# Altium project SAIL V3.PrjPcb
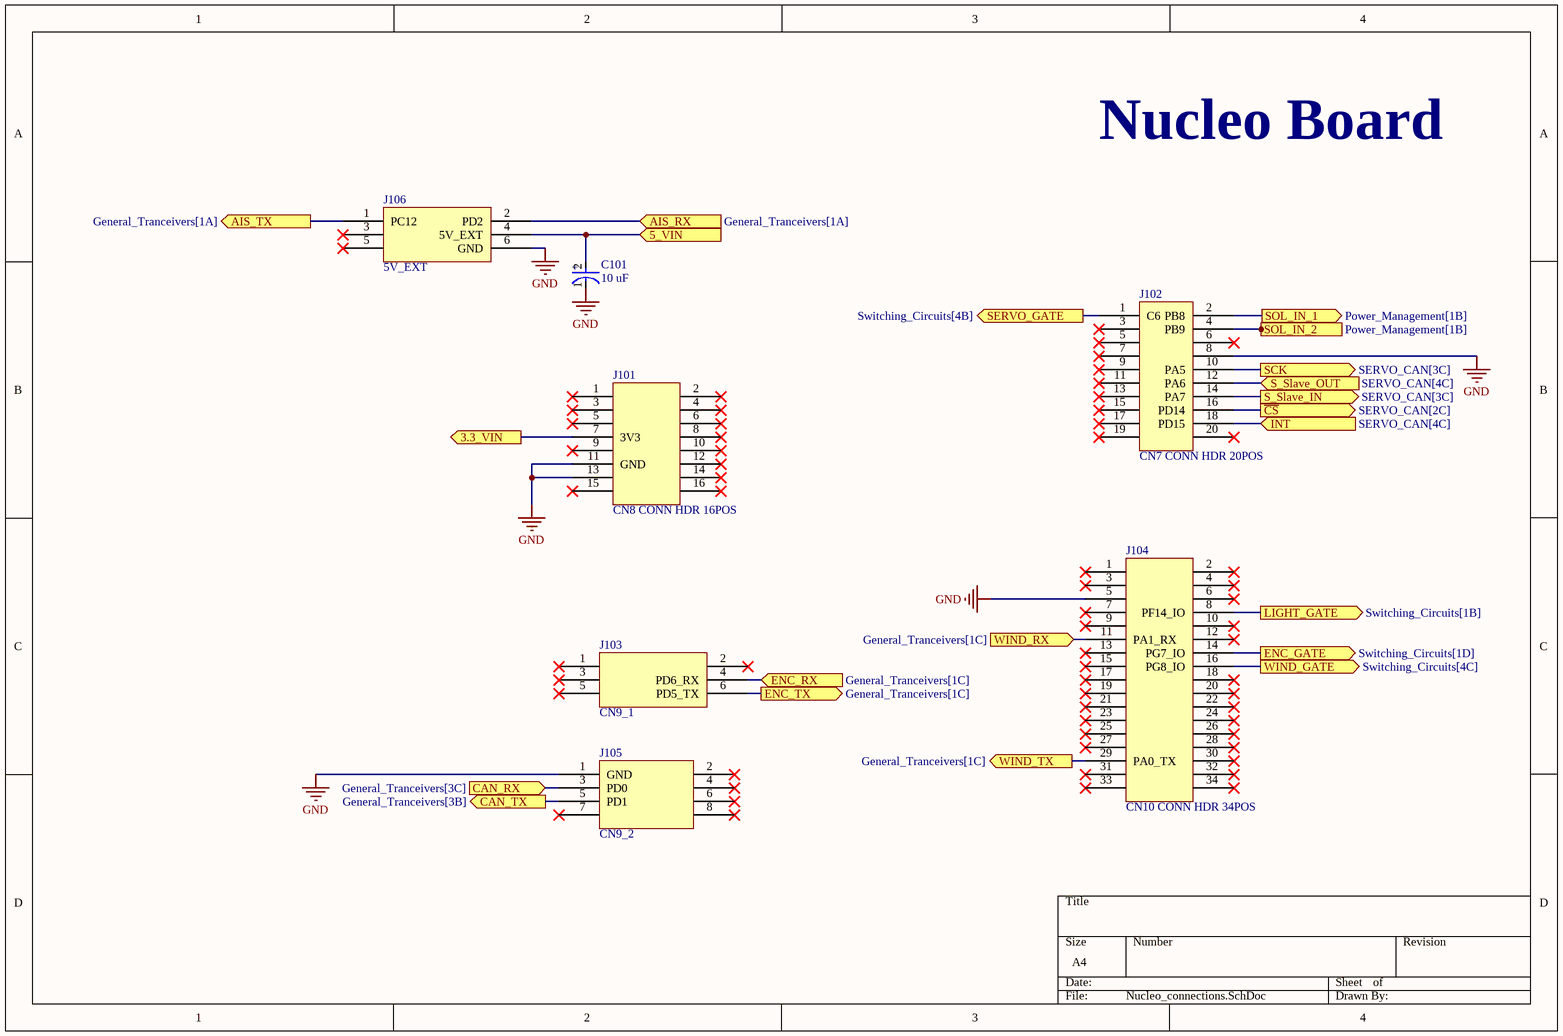
[diagram p0: Nucleo_connections.SchDoc]
2 sheets, 23 parts. Net scope: flat (ports and power ports of the same name join across sheets).
Board file: PCB2.PcbDoc
Sheets:
  Nucleo_connections.SchDoc
  General_Tranceivers.SchDoc

## Sheet Nucleo_connections.SchDoc
size A4; SheetNumber: 1; SheetTotal: 7

### Parts
C101  10 uF  [FP-RAD-TH-D_10_0_5-L_20_2-MFG]
J101  CN8 CONN HDR 16POS  [CN8_8X2_PADS]
J102  CN7 CONN HDR 20POS  [CN7_10X2_PADS]
J103  CN9_1  [5V_EXT]
J104  CN10 CONN HDR 34POS  [CN10_17X2_PADS]
J105  CN9_2  [4x2]
J106  5V_EXT  [5V_EXT]

### Ports
3.3_VIN (out, see General_Tranceivers[1B], General_Tranceivers[1D], General_Tranceivers[2B], SERVO_CAN[1B], SERVO_CAN[2C]), 5_VIN (in, see Data_PWR_Connectors[1C], General_Tranceivers[2B], Power_Management[3A], Power_Management[4C], SERVO_CAN[1B]), AIS_RX (in, see General_Tranceivers[1A]), AIS_TX (out, see General_Tranceivers[1A]), CAN_RX (in, see General_Tranceivers[3C]), CAN_TX (out, see General_Tranceivers[3B]), ENC_GATE (out, see Switching_Circuits[1D]), ENC_RX (in, see General_Tranceivers[1C]), ENC_TX (out, see General_Tranceivers[1C]), INT (in, see SERVO_CAN[4C]), LIGHT_GATE (out, see Switching_Circuits[1B]), S_Slave_IN (out, see SERVO_CAN[3C]), S_Slave_OUT (in, see SERVO_CAN[4C]), SCK (out, see SERVO_CAN[3C]), SERVO_GATE (out, see Switching_Circuits[4B]), SOL_IN_1 (out, see Power_Management[1B]), SOL_IN_2 (out, see Power_Management[1B]), WIND_GATE (out, see Switching_Circuits[4C]), WIND_RX (in, see General_Tranceivers[1C]), WIND_TX (out, see General_Tranceivers[1C]), ~{CS} (out, see SERVO_CAN[2C])

### Nets
GND: C101.1(C) J101.11(GND) J101.13(GND) J102.8 J104.5 J105.1(GND) J106.6(GND)
NetC101_2: C101.2(A) J106.4(5V_EXT) ; port 5_VIN
NetC203_1: J101.7(3V3) ; port 3.3_VIN
NetJ102_1: J102.1(C6) ; port SERVO_GATE
NetJ102_2: J102.2(PB8) ; port SOL_IN_1
NetJ102_4: J102.4(PB9) ; port SOL_IN_2
NetJ102_10: J102.10(PA5) ; port SCK
NetJ102_12: J102.12(PA6) ; port S_Slave_OUT
NetJ102_14: J102.14(PA7) ; port S_Slave_IN
NetJ102_16: J102.16(PD14) ; port ~{CS}
NetJ102_18: J102.18(PD15) ; port INT
NetJ103_4: J103.4(PD6_RX) ; port ENC_RX
NetJ103_6: J103.6(PD5_TX) ; port ENC_TX
NetJ104_8: J104.8(PF14_IO) ; port LIGHT_GATE
NetJ104_11: J104.11(PA1_RX) ; port WIND_RX
NetJ104_14: J104.14(PG7_IO) ; port ENC_GATE
NetJ104_16: J104.16(PG8_IO) ; port WIND_GATE
NetJ104_29: J104.29(PA0_TX) ; port WIND_TX
NetJ105_3: J105.3(PD0) ; port CAN_RX
NetJ105_5: J105.5(PD1) ; port CAN_TX
NetJ106_1: J106.1(PC12) ; port AIS_TX
NetJ106_2: J106.2(PD2) ; port AIS_RX

Not connected (* = marked no-connect by the designer): J101 1* 2* 3* 4* 5* 6* 8* 9* 10* 12* 14(PF3_IO)* 15(VIN)* 16(PF5_IO)*; J102 3* 5* 6* 7* 9* 11* 13* 15* 17* 19* 20*; J103 1(PA3_IO)* 2(PD2)* 3(PA2_IO)* 5(7)*; J104 1* 2* 3* 4* 6* 7* 9* 10* 12* 13* 15* 17* 18* 19* 20* 21* 22* 23* 24* 25* 26* 27* 28* 30* 31* 32* 33* 34*; J105 2* 4* 6* 7* 8*; J106 3(VDD)* 5(7)*

### Notes on the sheet
- Nucleo Board
- (in symbol CMP-05427-000989-1) +

### Library data of the parts
C101 = CMP-05427-000989-1: Aluminum Electrolytic Capacitors (Radial Lead Type) 10uF ±20% 350V; Ripple Current: 115mA; Dissipation Factor: 0.2%; Lead Diameter: 0.6mm; Lead/Base Style: Straight; Life (Hours): 2000Hour; Diameter: 10mm; Tolerance: 20%; RoHS Compliant: Yes; Voltage Rating: 350V; Construction: RADIAL; Radiation Hardening: No; Packaging: Bulk; Height: 20mm; Termination: Radial; Height - Seated (Max): 0.866inch; Voltage Rating (DC): 350V; Max Operating Temperature: 85°C; Lead Pitch: 5mm; Ripple Current (AC): 115mA; Length: 20mm; Case/Package: Radial; Mount: Through Hole; Series: M; Min Operating Temperature: -25°C; REACH SVHC: No SVHC; Capacitance: 10uF; Package Quantity: 200
J101 = CN8 CONN HDR 16POS: CN8 CONN HDR 16POS 0.1 STACK
J102 = CN7 CONN HDR 20POS: CN7 CONN HDR 20 POS  0.1 STACK
J103 = 5V_EXT
J104 = CN10 CONN HDR 34POS: CN10 CONN HDR 34 POS  0.1 STACK
J105 = 4x2

## Sheet General_Tranceivers.SchDoc
size A4; SheetNumber: 2; SheetTotal: 7
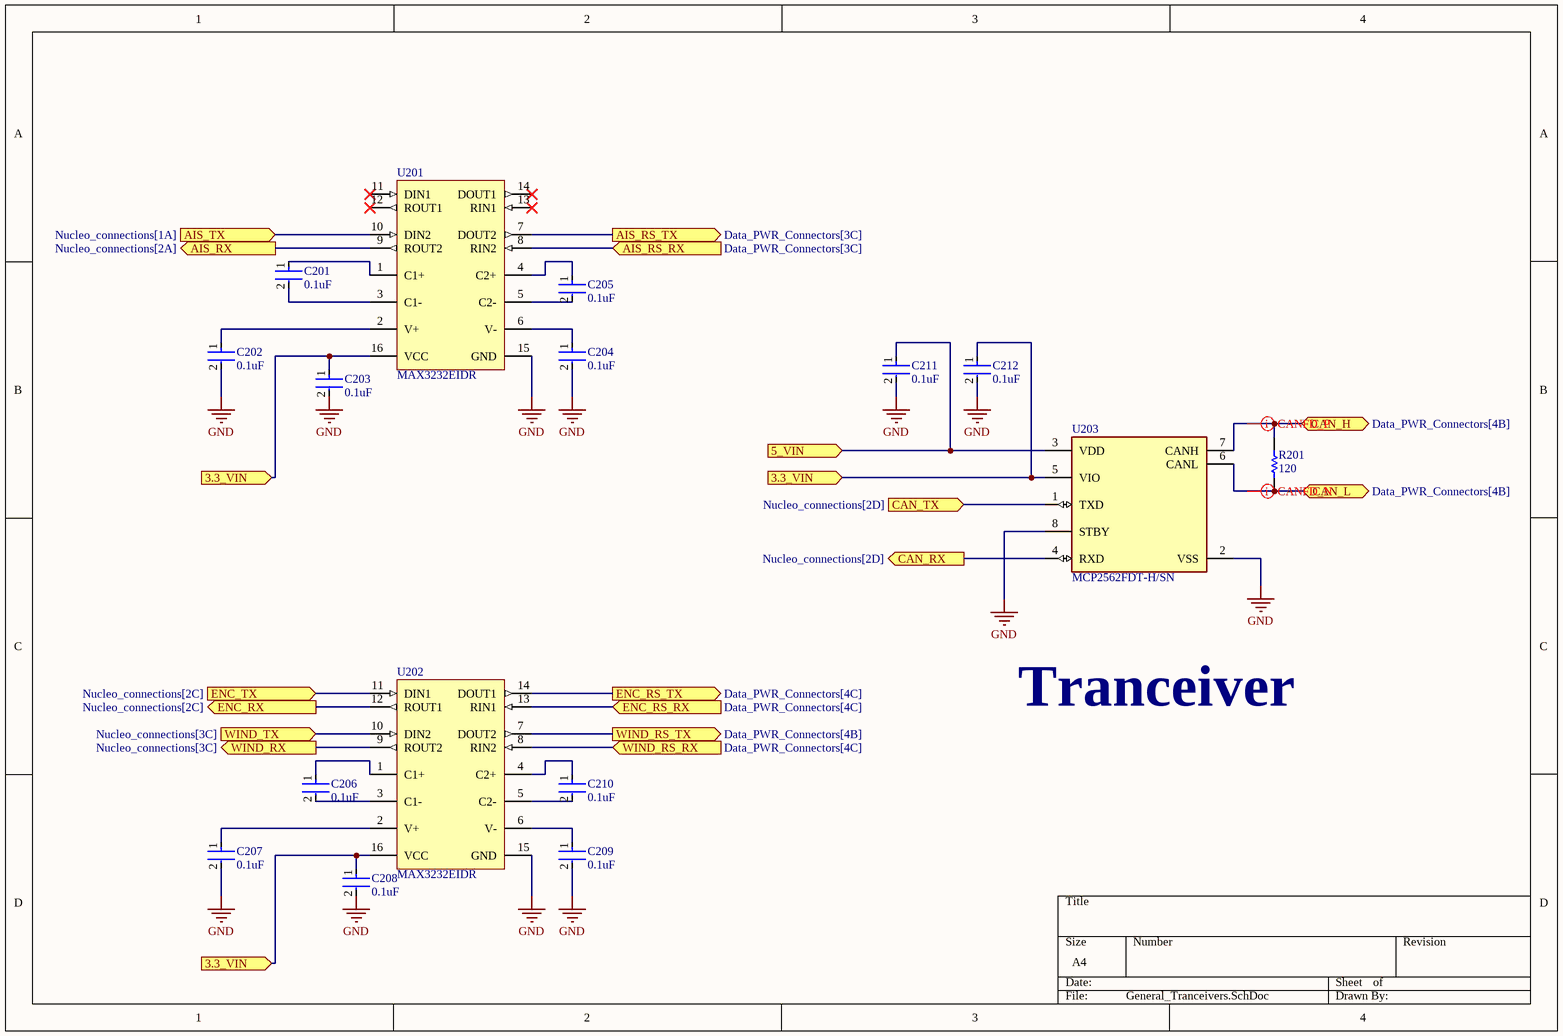
[diagram p1: General_Tranceivers.SchDoc]

### Parts
C201  0.1uF  [FP-GCM21B-0_15-MFG]
C202  0.1uF  [FP-GCM21B-0_15-MFG]
C203  0.1uF  [FP-GCM21B-0_15-MFG]
C204  0.1uF  [FP-GCM21B-0_15-MFG]
C205  0.1uF  [FP-GCM21B-0_15-MFG]
C206  0.1uF  [FP-GCM21B-0_15-MFG]
C207  0.1uF  [FP-GCM21B-0_15-MFG]
C208  0.1uF  [FP-GCM21B-0_15-MFG]
C209  0.1uF  [FP-GCM21B-0_15-MFG]
C210  0.1uF  [FP-GCM21B-0_15-MFG]
C211  0.1uF  [FP-GCM21B-0_15-MFG]
C212  0.1uF  [FP-GCM21B-0_15-MFG]
R201  120  [RESC2013X60X35ML10T20]
U201  MAX3232EIDR  [D0016A_N]
U202  MAX3232EIDR  [D0016A_N]
U203  MCP2562FDT-H/SN  [FP-C04-057-SN-IPC_A]

### Ports
3.3_VIN (in, see General_Tranceivers[1B], General_Tranceivers[1D], Nucleo_connections[2B], SERVO_CAN[1B], SERVO_CAN[2C]), 3.3_VIN (in, see General_Tranceivers[1B], General_Tranceivers[2B], Nucleo_connections[2B], SERVO_CAN[1B], SERVO_CAN[2C]), 3.3_VIN (in, see General_Tranceivers[1D], General_Tranceivers[2B], Nucleo_connections[2B], SERVO_CAN[1B], SERVO_CAN[2C]), 5_VIN (in, see Data_PWR_Connectors[1C], Nucleo_connections[2A], Power_Management[3A], Power_Management[4C], SERVO_CAN[1B]), AIS_RS_RX (in, see Data_PWR_Connectors[3C]), AIS_RS_TX (out, see Data_PWR_Connectors[3C]), AIS_RX (out, see Nucleo_connections[2A]), AIS_TX (in, see Nucleo_connections[1A]), CAN_H (bidir, see Data_PWR_Connectors[4B]), CAN_L (bidir, see Data_PWR_Connectors[4B]), CAN_RX (out, see Nucleo_connections[2D]), CAN_TX (in, see Nucleo_connections[2D]), ENC_RS_RX (in, see Data_PWR_Connectors[4C]), ENC_RS_TX (out, see Data_PWR_Connectors[4C]), ENC_RX (out, see Nucleo_connections[2C]), ENC_TX (in, see Nucleo_connections[2C]), WIND_RS_RX (in, see Data_PWR_Connectors[4C]), WIND_RS_TX (out, see Data_PWR_Connectors[4B]), WIND_RX (out, see Nucleo_connections[3C]), WIND_TX (in, see Nucleo_connections[3C])

### Nets
GND: C202.2 C203.2 C204.2 C207.2 C208.2 C209.2 C211.2 C212.2 U201.15(GND) U202.15(GND) U203.2(VSS) U203.8(STBY)
NetC101_2: C211.1 U203.3(VDD) ; port 5_VIN
NetC201_1: C201.1 U201.1(C1+)
NetC201_2: C201.2 U201.3(C1-)
NetC202_1: C202.1 U201.2(V+)
NetC203_1: C203.1 C208.1 C212.1 U201.16(VCC) U202.16(VCC) U203.5(VIO) ; port 3.3_VIN
NetC204_1: C204.1 U201.6(V-)
NetC205_1: C205.1 U201.4(C2+)
NetC205_2: C205.2 U201.5(C2-)
NetC206_1: C206.1 U202.1(C1+)
NetC206_2: C206.2 U202.3(C1-)
NetC207_1: C207.1 U202.2(V+)
NetC209_1: C209.1 U202.6(V-)
NetC210_1: C210.1 U202.4(C2+)
NetC210_2: C210.2 U202.5(C2-)
NetJ103_4: U202.12(ROUT1) ; port ENC_RX
NetJ103_6: U202.11(DIN1) ; port ENC_TX
NetJ104_11: U202.9(ROUT2) ; port WIND_RX
NetJ104_29: U202.10(DIN2) ; port WIND_TX
NetJ105_3: U203.4(RXD) ; port CAN_RX
NetJ105_5: U203.1(TXD) ; port CAN_TX
NetJ106_1: U201.10(DIN2) ; port AIS_TX
NetJ106_2: U201.9(ROUT2) ; port AIS_RX
NetR201_1: R201.1 U203.7(CANH) ; port CAN_H
NetR201_2: R201.2 U203.6(CANL) ; port CAN_L
NetU201_7: U201.7(DOUT2) ; port AIS_RS_TX
NetU201_8: U201.8(RIN2) ; port AIS_RS_RX
NetU202_7: U202.7(DOUT2) ; port WIND_RS_TX
NetU202_8: U202.8(RIN2) ; port WIND_RS_RX
NetU202_13: U202.13(RIN1) ; port ENC_RS_RX
NetU202_14: U202.14(DOUT1) ; port ENC_RS_TX

Not connected (* = marked no-connect by the designer): U201 11(DIN1)* 12(ROUT1)* 13(RIN1)* 14(DOUT1)*

### Layout directives
differential pair: NetR201_1, NetR201_2

### Notes on the sheet
- Tranceiver

### Library data of the parts
C201-C212 = CMP-2007-03364-2: Ceramic Capacitor for Automotive 100nF ±10% 100VDC X7R 0805 Embossed T/R; Voltage Rating: 100V; Termination: SMD/SMT; Tolerance: 10%; Case Code (Imperial): 0805; Length: 2mm; Max Operating Temperature: 125°C; Case/Package: 0805; Mount: Surface Mount; Packaging: Tape and Reel; Package Quantity: 1; Min Operating Temperature: -55°C; Case Code (Metric): 2012; Radiation Hardening: No; REACH SVHC: No SVHC; Dielectric: X7R; Depth: 1.25mm; Lead Free: Lead Free; Ratings: AEC-Q200; Height: 1.25mm; Voltage: 100V; Capacitance: 100nF; Voltage Rating (DC): 100V; Width: 0.049inch; Thickness: 0.055inch
R201 = CMP-2100-03671-1: Chip Resistor, 1 KOhm, +/- 1%, 125 mW, -55 to 155 degC, 0805 (2012 Metric), RoHS, Tape and Reel; Manufacturer: Yageo; Temperature Coefficient: 100ppm/degreesC; Voltage Rating (DC): 150V; Max Power Dissipation: 125mW; Resistance: 1KOhm; Number of Pins: 2; Number of Terminations: 2; Datasheet URL: http://www.yageo.com/NewPortal/yageodocoutput?fileName=/pdf/R-Chip/PYu-RC_Group_51_RoHS_L_5.pdf; Length: 0.079inch; Package Description: 2-Pin Surface Mounted Device, Body 2 x 1.25 mm; Depth: 1.25mm; Height: 0.024inch; Military Standard: Not; Case/Package: 0805; Package Reference: 0805; RoHSCompliant: true; Lead Free: LeadFree; Packaging: TapeandReel; Package Quantity: 1; Datasheet Version: Rev. 5, 10/2016; Tolerance: 1%; Min Operating Temperature: -55degC; Voltage Rating: 150V; Composition: ThickFilm; Case Code (Imperial): 0805; Power Rating: 125mW; Width: 0.049inch; Case Code (Metric): 2012; Manufacturer URL: http://www.yageo.com/; Max Operating Temperature: 155degC; REACH SVHC: Unknown; Termination: SMD/SMT
U201 U202 = CMP-0299-00792-2: 3-V to 5.5-V Multichannel RS-232 Line Driver / Receiver with ±15-kV IEC ESD Protection, -40 to 85 degC, 16-Pin SOIC (D), Green (RoHS & no Sb/Br); Drivers Per Package: 2; IEC-61000-4-2 SUPPORT: TRUE; Supply Voltage(s)(V): 3.3 or 5.0; ICC(Max)(mA): 1; ESD HBM(kV): +/-15; PackageVersion: revM, Jun-2011; ComponentLink2URL: http://www.ti.com/general/docs/lit/getliterature.tsp?genericPartNumber=MAX3232E&fileType=pdf; PackageReference: D0016A; DatasheetVersion: SLLS664A; ComponentLink3Description: Package Specification; PackageDescription: 16-Pin Plastic Small Outline Integrated Circuit, 9.9 x 3.9 mm, Pitch 1.27 mm Pitch; SubFamily: RS-232; Single Supply: TRUE; RS-232: TRUE; ComponentLink1Description: Manufacturer URL; ComponentLink1URL: www.ti.com; ComponentLink3URL: http://www.ti.com/litv/pdf/mpds178g; Receivers Per Package: 2; ComponentLink2Description: Datasheet
U203 = CMP-06279-000047-1: IC TRANSCEIVER 1/1 8SOIC; Operating Supply Current: 70mA; Receiver Hysteresis: 200mV; Max Supply Voltage: 5.5V; Number of Transceivers: 1; Min Supply Voltage: 4.5V; Data Rate: 8Mbps; Case/Package: SOIC; Weight: 0.019048oz; Package Quantity: 3300; Max Operating Temperature: 150°C; Packaging: Tape and Reel; RoHS Compliant: Yes; Series: -; Number of Pins: 8; Min Operating Temperature: -40°C; Mount: Surface Mount

## Nets that join several sheets
GND: Nucleo_connections (7 pins), General_Tranceivers (12 pins)
NetC101_2: Nucleo_connections (C101.2 J106.4), General_Tranceivers (C211.1 U203.3)
NetC203_1: Nucleo_connections (J101.7), General_Tranceivers (6 pins)
NetJ103_4: Nucleo_connections (J103.4), General_Tranceivers (U202.12)
NetJ103_6: Nucleo_connections (J103.6), General_Tranceivers (U202.11)
NetJ104_11: Nucleo_connections (J104.11), General_Tranceivers (U202.9)
NetJ104_29: Nucleo_connections (J104.29), General_Tranceivers (U202.10)
NetJ105_3: Nucleo_connections (J105.3), General_Tranceivers (U203.4)
NetJ105_5: Nucleo_connections (J105.5), General_Tranceivers (U203.1)
NetJ106_1: Nucleo_connections (J106.1), General_Tranceivers (U201.10)
NetJ106_2: Nucleo_connections (J106.2), General_Tranceivers (U201.9)